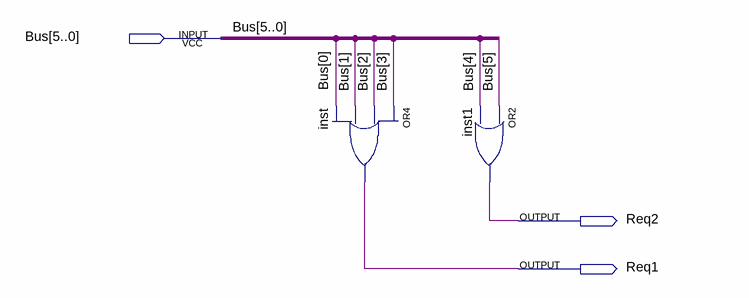
[diagram p0: schematic sheet]
// Quartus schematic Parser.bdf as structural Verilog: 2 symbols, 3 pins
module Parser (
  input  [5:0] Bus,
  output Req2,
  output Req1
);

  or inst (Req1, Bus[3], Bus[2], Bus[1], Bus[0]);
  or inst1 (Req2, Bus[5], Bus[4]);
endmodule
